# EAGLE board OEPS_V2 (EAGLE 9.5.2)
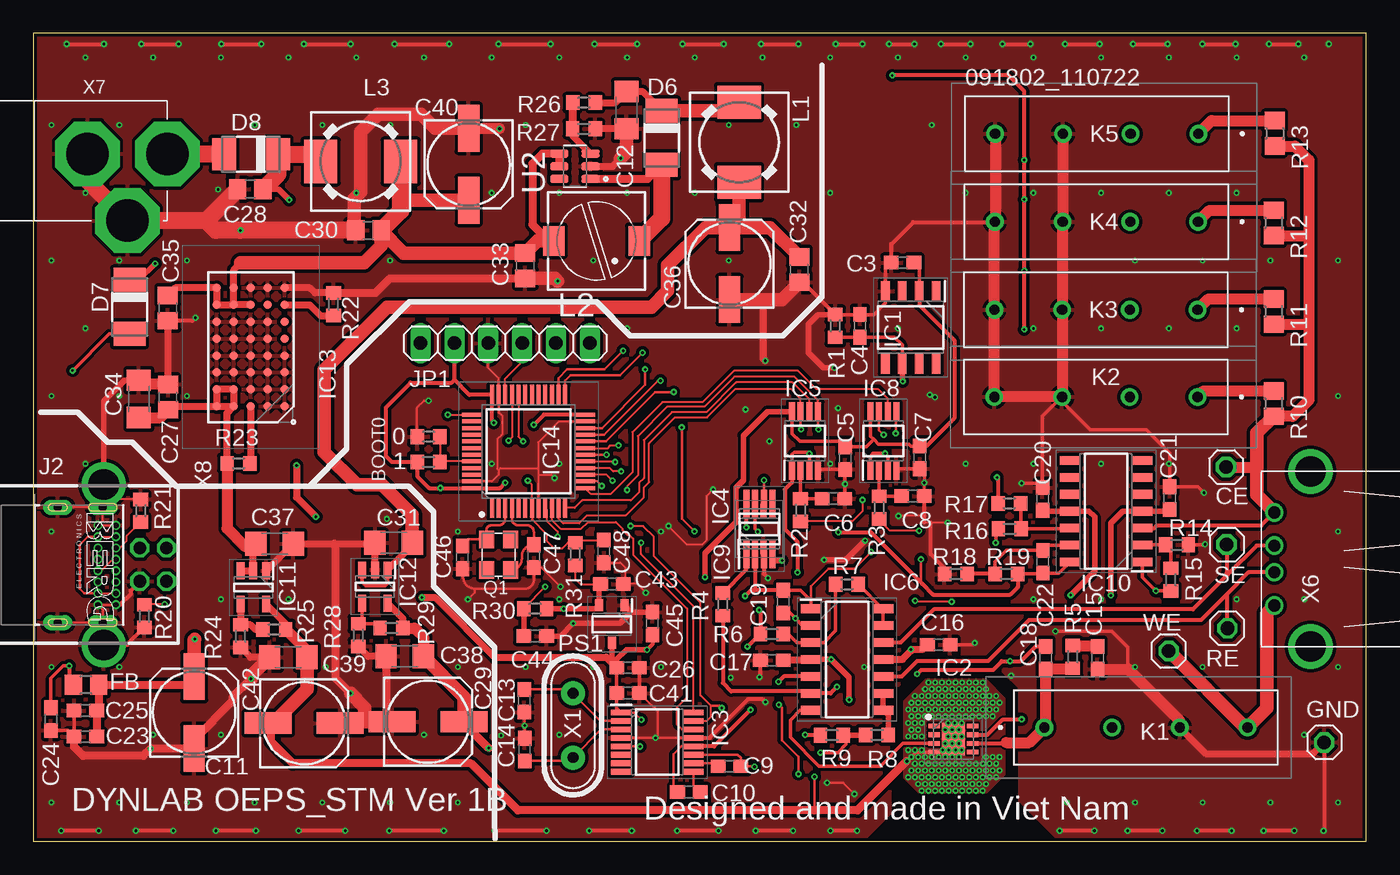
[diagram p5: board, top side]
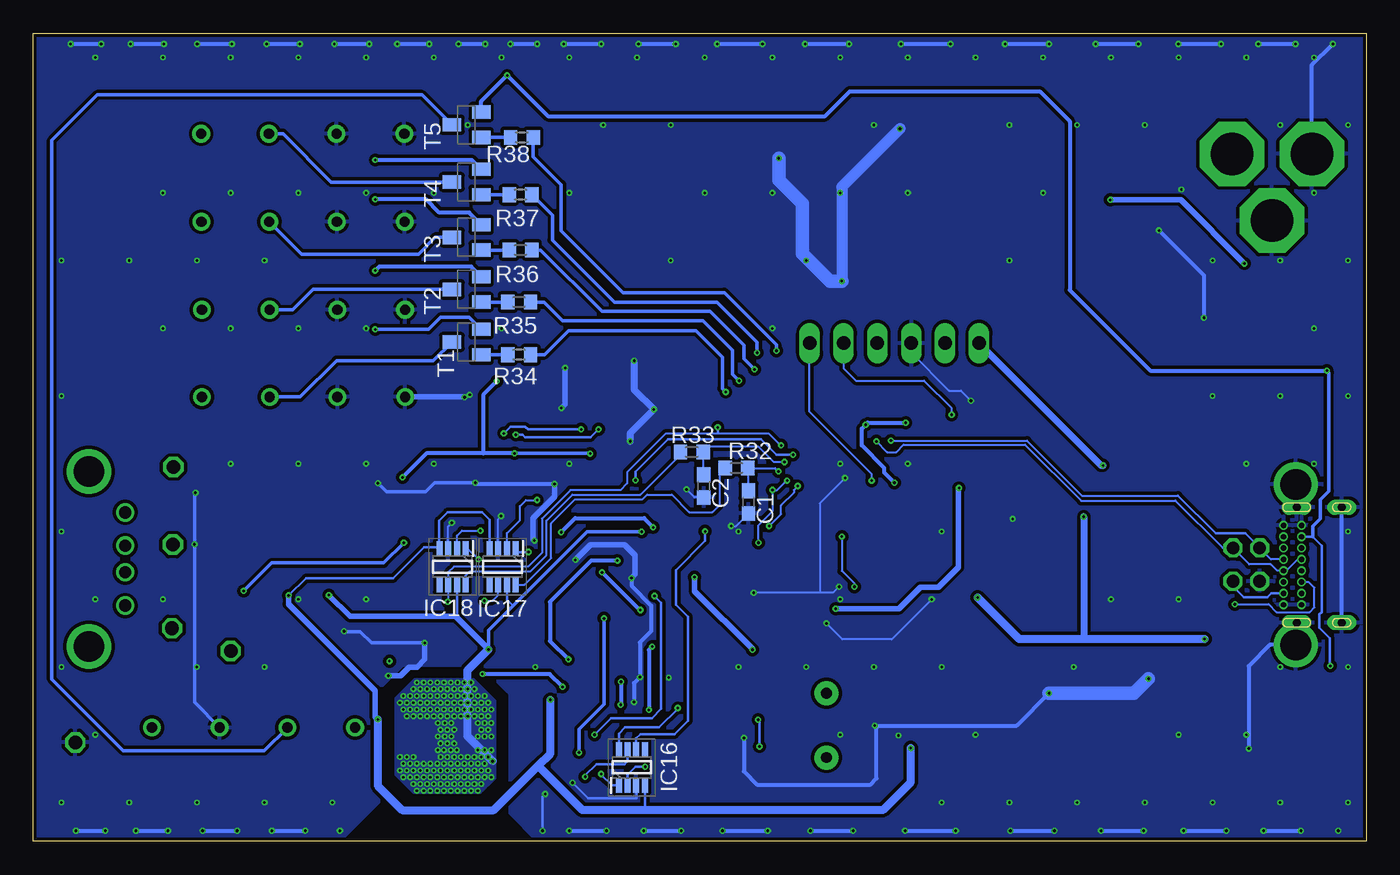
[diagram p6: board, bottom side, seen from below]

Size 100 x 60.6 mm. Coordinates in mm from the lower left corner, seen from the top.
Outline: 0,0 100,0 100,60.6 0,60.6 0,0
Copper layers (1*16): Top 0.035mm / dielectric 1.5mm / Bottom 0.035mm
Design rules "default *": minimum track width 6mil, minimum drill 7mil, track to track 6mil, track to pad 6mil, pad to pad 6mil, via to via 6mil, smd to smd 6mil, copper to edge 0.2mm, drill to drill 6mil, minimum pad ring 5mil, minimum via ring 5mil, stop-mask expansion 4mil, vias tented up to drill 10mil, thermal gap 10mil

## Footprints (pad centres in the part's own frame; a part is rotated, then mirrored left to right if it is on the bottom)
R0603 = smd 1 x 1.1: 1 -0.85,0; 2 0.85,0
C0603 = smd 1.1 x 1: 1 -0.85,0; 2 0.85,0
153CLV-0605 = smd 3.5 x 1.6: + 2.7,0; - -2.7,0
C1206 = smd 1.6 x 1.8: 1 -1.4,0; 2 1.4,0
C0805 = smd 1.3 x 1.5: 1 -0.95,0; 2 0.95,0
1X01 = drill 1.016 octagon: 1 0,0
DO-214AC = smd 1.8 x 2.4: A 2.025,0; C -2.025,0
R0805 = smd 1.3 x 1.5: 1 -0.95,0; 2 0.95,0
SOIC127P600X175-8N = smd 1.525 x 0.65: 1 -2.712,1.905; 2 -2.712,0.635; 3 -2.712,-0.635; 4 -2.712,-1.905; 5 2.712,-1.905; 6 2.712,-0.635; 7 2.712,0.635; 8 2.712,1.905
SON65P300X300X100-9N = smd 0.85 x 0.35: 1 -1.45,0.975; 2 -1.45,0.325; 3 -1.45,-0.325; 4 -1.45,-0.975; 5 1.45,-0.975; 6 1.45,-0.325; 7 1.45,0.325; 8 1.45,0.975 | smd 1.7 x 2.45: 9 0,0
SOP64P600X175-16N = smd 1.528 x 0.435: 1 -2.711,2.222; 2 -2.711,1.588; 3 -2.711,0.952; 4 -2.711,0.318; 5 -2.711,-0.318; 6 -2.711,-0.952; 7 -2.711,-1.588; 8 -2.711,-2.222; 9 2.711,-2.222; 10 2.711,-1.588; 11 2.711,-0.952; 12 2.711,-0.318; 13 2.711,0.318; 14 2.711,0.952; 15 2.711,1.588; 16 2.711,2.222
SOP65P280X145-8N = smd 1.088 x 0.45: 1 -1.356,0.975; 2 -1.356,0.325; 3 -1.356,-0.325; 4 -1.356,-0.975; 5 1.356,-0.975; 6 1.356,-0.325; 7 1.356,0.325; 8 1.356,0.975
SOP65P490X110-8N@1 = smd 1.4 x 0.45: 1 -2.2,0.975; 2 -2.2,0.325; 3 -2.2,-0.325; 4 -2.2,-0.975; 5 2.2,-0.975; 6 2.2,-0.325; 7 2.2,0.325; 8 2.2,0.975
SOIC127P600X175-14N = smd 1.525 x 0.65: 1 -2.712,3.81; 2 -2.712,2.54; 3 -2.712,1.27; 4 -2.712,0; 5 -2.712,-1.27; 6 -2.712,-2.54; 7 -2.712,-3.81; 8 2.712,-3.81; 9 2.712,-2.54; 10 2.712,-1.27; 11 2.712,0; 12 2.712,1.27; 13 2.712,2.54; 14 2.712,3.81
SOP65P490X110-8N = smd 1.45 x 0.45: 1 -2.225,0.975; 2 -2.225,0.325; 3 -2.225,-0.325; 4 -2.225,-0.975; 5 2.225,-0.975; 6 2.225,-0.325; 7 2.225,0.325; 8 2.225,0.975
SOT95P280X100-5N = smd 1.25 x 0.6: 1 -1.25,0.95; 2 -1.25,0; 3 -1.25,-0.95; 4 1.25,-0.95; 5 1.25,0.95
BGA40C127P5X8_625X1125X512 = smd 0.635 x 0.635: A1 -2.54,4.445; A2 -1.27,4.445; A3 0,4.445; A4 1.27,4.445; A5 2.54,4.445; B1 -2.54,3.175; B2 -1.27,3.175; B3 0,3.175; B4 1.27,3.175; B5 2.54,3.175; C1 -2.54,1.905; C2 -1.27,1.905; C3 0,1.905; C4 1.27,1.905; C5 2.54,1.905; D1 -2.54,0.635; D2 -1.27,0.635; D3 0,0.635; D4 1.27,0.635; D5 2.54,0.635; E1 -2.54,-0.635; E2 -1.27,-0.635; E3 0,-0.635; E4 1.27,-0.635; E5 2.54,-0.635; F1 -2.54,-1.905; F2 -1.27,-1.905; F3 0,-1.905; F4 1.27,-1.905; F5 2.54,-1.905; G1 -2.54,-3.175; G2 -1.27,-3.175; G3 0,-3.175; G4 1.27,-3.175; G5 2.54,-3.175; H1 -2.54,-4.445; H2 -1.27,-4.445; H3 0,-4.445; H4 1.27,-4.445; H5 2.54,-4.445
QFP50P900X900X160-48N = smd 1.475 x 0.3: 1 -4.238,2.75; 2 -4.238,2.25; 3 -4.238,1.75; 4 -4.238,1.25; 5 -4.238,0.75; 6 -4.238,0.25; 7 -4.238,-0.25; 8 -4.238,-0.75; 9 -4.238,-1.25; 10 -4.238,-1.75; 11 -4.238,-2.25; 12 -4.238,-2.75; 25 4.238,-2.75; 26 4.238,-2.25; 27 4.238,-1.75; 28 4.238,-1.25; 29 4.238,-0.75; 30 4.238,-0.25; 31 4.238,0.25; 32 4.238,0.75; 33 4.238,1.25; 34 4.238,1.75; 35 4.238,2.25; 36 4.238,2.75 | smd 0.3 x 1.475: 13 -2.75,-4.238; 14 -2.25,-4.238; 15 -1.75,-4.238; 16 -1.25,-4.238; 17 -0.75,-4.238; 18 -0.25,-4.238; 19 0.25,-4.238; 20 0.75,-4.238; 21 1.25,-4.238; 22 1.75,-4.238; 23 2.25,-4.238; 24 2.75,-4.238; 37 2.75,4.238; 38 2.25,4.238; 39 1.75,4.238; 40 1.25,4.238; 41 0.75,4.238; 42 0.25,4.238; 43 -0.25,4.238; 44 -0.75,4.238; 45 -1.25,4.238; 46 -1.75,4.238; 47 -2.25,4.238; 48 -2.75,4.238
GCT_USB4085-GF-A_REVA = drill 0.4 pad 0.65: A1 -2.975,4.025; A4 -2.125,4.025; A5 -1.275,4.025; A6 -0.425,4.025; A7 0.425,4.025; A8 1.275,4.025; A9 2.125,4.025; A12 2.975,4.025; B1 2.975,2.675; B4 2.125,2.675; B5 1.275,2.675; B6 0.425,2.675; B7 -0.425,2.675; B8 -1.275,2.675; B9 -2.125,2.675; B12 -2.975,2.675 | drill 0.6 pad 1.108 long: P1 -4.325,3.045; P2 4.325,3.045; P3 4.325,-0.335; P4 -4.325,-0.335
1X06 = drill 1.016 long: 1 -6.35,0; 2 -3.81,0; 3 -1.27,0; 4 1.27,0; 5 3.81,0; 6 6.35,0
90070501 = drill 0.77 pad 1.32: 1 0,0; 2 5.08,0; 3 10.16,0; 4 15.24,0
DR74 = smd 2.5 x 3.25: 1 -3,0; 2 3,0
PIS2816 = smd 2.2 x 1.6: 1 0,3.2; 2 0,-3.2
SOT95P280X130-3N = smd 0.9 x 0.6: 1 -1.4,0.95; 2 -1.4,-0.95; 3 1.4,0
3.2X2.5_KX-7 = smd 1.3 x 1.1: 1 -1.15,-0.9; 2 1.15,-0.9; 3 1.15,0.9; 4 -1.15,0.9
SOT23-BEC = smd 1 x 1.4: B -0.95,-1.1; C 0,1.1; E 0.95,-1.1
SOT95P280X145-6N = smd 1.37 x 0.59: 1 -1.17,0.95; 2 -1.17,0; 3 -1.17,-0.95; 4 1.17,-0.95; 5 1.17,0; 6 1.17,0.95
HC49 = drill 0.813 pad 1.8: 1 -2.413,0; 2 2.413,0
USB-A-H = drill 0.914: D+ 2.718,-1.003; D- 2.718,1.003; GND 2.718,-3.493; VBUS 2.718,3.493 | drill 2.311: P$5 0,-6.566; P$6 0,6.566
DC-21MM = drill 3.2 pad 4.826 octagon: 1 -5.08,-3.353; 2 -0.076,-6.35; 3 -0.076,-0.356
PN61729-S = drill 0.95 octagon: 1 1.25,4.71; 2 -1.25,4.71; 3 -1.25,2.71; 4 1.25,2.71 | drill 2.3 pad 2.9: S1 -6.02,0; S2 6.02,0

## Placement (x,y rotation side)
0  10K  [R0603]  29.65,30.35 0 top
1  10K  [R0603]  29.65,28.45 180 top
C1  100nF  [C0603]  46.35,25.45 270 bottom
C2  100nF  [C0603]  49.7,26.65 270 bottom
C3  100nF  [C0603]  65.22,43.4 180 top
C4  100nF  [C0603]  62.02,38.66 90 top
C5  100nF  [C0603]  60.9,28.75 270 top
C6  100nF  [C0603]  60.03,25.7 0 top
C7  100nF  [C0603]  66.5,28.79 270 top
C8  100nF  [C0603]  65.99,25.9 0 top
C9  3.3nF  [C0603]  52.23,5.63 180 top
C10  10nF  [C0603]  49.19,3.7 0 top
C11  6.3V_470uF  [153CLV-0605]  12.07,9.66 90 top
C12  22uF  [C1206]  44.5,54.84 270 top
C13  12pF  [C0603]  36.83,10.55 270 top
C14  12pF  [C0603]  36.87,6.88 90 top
C15  100nF  [C0603]  79.85,13.76 270 top
C16  100nF  [C0603]  67.93,14.74 0 top
C17  100nF  [C0603]  55.4,13.58 0 top
C18  4700pF  [C0603]  75.95,13.76 90 top
C19  12pF  [C0603]  56.26,17.98 270 top
C20  100nF  [C0603]  75.72,25.68 90 top
C21  100nF  [C0603]  85.25,25.75 90 top
C22  12pF  [C0603]  75.74,20.97 90 top
C23  100nF  [C0603]  3.91,7.85 180 top
C24  10nF  [C0603]  1.32,9.17 270 top
C25  10uF  [C0603]  3.91,9.81 180 top
C26  100nF  [C0603]  44.62,13.01 0 top
C27  100nF  [C0805]  10.1,33.32 90 top
C28  100nF  [C0805]  16.28,48.92 180 top
C29  16V_220uF  [153CLV-0605]  29.62,8.97 0 top
C30  100nF  [C0805]  25.14,45.82 180 top
C31  22uF  [C1206]  27.03,22.38 0 top
C32  0.1uF  [C0805]  57.47,42.89 270 top
C33  0.1uF  [C0805]  36.91,43.17 270 top
C34  22uF  [C1206]  7.92,33.18 90 top
C35  100nF  [C0805]  10.09,39.99 270 top
C36  25V_100uF  [153CLV-0605]  52.23,43.33 90 top
C37  22uF  [C1206]  18.11,22.33 180 top
C38  22uF  [C1206]  27.86,13.87 0 top
C39  22uF  [C1206]  19.13,13.8 0 top
C40  25V_100uF  [153CLV-0605]  32.66,50.78 270 top
C41  10uF  [C0603]  44.62,11.11 0 top
C42  16V_220uF  [153CLV-0605]  20.32,8.87 0 top
C43  10uF  [C0603]  43.4,19.3 0 top
C44  100nF  [C0603]  37.65,15.4 0 top
C45  100nF  [C0603]  46.45,16.35 90 top
C46  10pF  [C0603]  32.2,21.3 90 top
C47  10pF  [C0603]  37.55,21.4 90 top
C48  100nF  [C0603]  42.8,21.75 270 top
CE  [1X01]  89.48,28.07 0 top
D6  SS34  [DO-214AC]  47.15,52.76 270 top
D7  SS34  [DO-214AC]  7.23,40.08 270 top
D8  SS34  [DO-214AC]  16.33,51.53 180 top
FB  0R  [R0805]  3.96,11.74 180 top
GND  [1X01]  96.85,7.42 0 top
IC1  ADR421BRZ  [SOIC127P600X175-8N]  65.83,38.55 270 top
IC2  BUF634AIDRBR  [SON65P300X300X100-9N]  69.03,7.67 0 top
IC3  DAC1220E_2K5  [SOP64P600X175-16N]  46.81,7.44 0 top
IC4  DG449DS-T1-E3  [SOP65P280X145-8N]  54.47,23.43 90 top
IC5  MCP3551T-E_MS  [SOP65P490X110-8N@1]  57.9,30.03 90 top
IC6  OPA4192ID  [SOIC127P600X175-14N]  61.05,13.64 0 top
IC8  MCP3551T-E_MS  [SOP65P490X110-8N@1]  63.78,30.03 90 top
IC9  ADG1419BRMZ  [SOP65P490X110-8N]  54.48,23.43 90 top
IC10  OPA4192ID  [SOIC127P600X175-14N]  80.48,24.76 180 top
IC11  ADP7182AUJZ-R7  [SOT95P280X100-5N]  16.51,19.05 270 top
IC12  ADP7118AUJZ-R7  [SOT95P280X100-5N]  25.63,19.11 270 top
IC13  LTM8045IY#PBF  [BGA40C127P5X8_625X1125X512]  16.31,37.07 180 top
IC14  STM32F072C8T6  [QFP50P900X900X160-48N]  37.15,29.25 90 top
IC16  DG449DS-T1-E3  [SOP65P280X145-8N]  55.1,5.55 90 bottom
IC17  DG449DS-T1-E3  [SOP65P280X145-8N]  64.8,20.6 270 bottom
IC18  DG449DS-T1-E3  [SOP65P280X145-8N]  68.55,20.6 270 bottom
J2  USB4085-GF-A_REVA  [GCT_USB4085-GF-A_REVA]  2.17,20.72 270 top
JP1  [1X06]  35.4,37.36 0 top
K1  9007-05-01  [90070501]  75.86,8.54 0 top
K2  9007-05-01  [90070501]  87.34,33.33 180 top
K3  9007-05-01  [90070501]  87.35,39.87 180 top
K4  9007-05-01  [90070501]  87.38,46.47 180 top
K5  9007-05-01  [90070501]  87.41,53.07 180 top
L1  CD74R-47uH  [DR74]  52.95,52.43 270 top
L2  22uH  [PIS2816]  42.25,45.03 270 top
L3  CD74R-47uH  [DR74]  24.56,50.99 0 top
PS1  XC6206P332MR-G  [SOT95P280X130-3N]  43.4,16.3 270 top
Q1  32M  [3.2X2.5_KX-7]  34.9,21.5 90 top
R1  10k  [R0603]  60.17,38.65 270 top
R2  1k  [R0603]  57.56,24.84 90 top
R3  1k  [R0603]  63.46,25.03 90 top
R4  10k  [R0603]  51.73,17.77 270 top
R5  27R  [R0603]  77.99,13.83 90 top
R6  75k*  [R0603]  55.41,15.54 180 top
R7  402k*  [R0603]  61.04,19.28 0 top
R8  402k*  [R0603]  63.29,7.98 0 top
R9  75k*  [R0603]  59.91,7.96 0 top
R10  1R*  [R0805]  93.05,32.83 270 top
R11  10R*  [R0805]  93.05,39.73 270 top
R12  1k*  [R0805]  93.05,46.38 270 top
R13  100k*  [R0805]  93.13,53.1 270 top
R14  2k*  [R0603]  85.81,22.24 0 top
R15  18k*  [R0603]  85.34,19.63 90 top
R16  75k*  [R0603]  73.25,23.44 180 top
R17  75k*  [R0603]  73.23,25.34 180 top
R18  75k*  [R0603]  69.22,20.04 0 top
R19  75k*  [R0603]  73.01,20.06 0 top
R20  5.1k  [R0603]  8.33,16.89 270 top
R21  5.1k  [R0603]  8.06,24.79 90 top
R22  60.4k  [R0603]  22.53,40.28 270 top
R23  178k  [R0603]  15.39,28.35 180 top
R24  8.87k*  [R0603]  15.55,15.39 270 top
R25  88.7k*  [R0603]  18.08,15.89 180 top
R26  27k  [R0603]  41.31,55.4 0 top
R27  1k  [R0603]  41.31,53.44 180 top
R28  10k*  [R0603]  24.39,15.47 270 top
R29  100k*  [R0603]  26.87,16 180 top
R30  100R  [R0603]  37.65,17.45 0 top
R31  10K  [R0603]  40.65,21.55 270 top
R32  1k  [R0603]  47.25,28 0 bottom
R33  1k  [R0603]  50.6,29.2 0 bottom
R34  1K  [R0603]  63.55,36.5 180 bottom
R35  1K  [R0603]  63.55,40.45 180 bottom
R36  1K  [R0603]  63.45,44.35 180 bottom
R37  1K  [R0603]  63.45,48.5 180 bottom
R38  1K  [R0603]  63.35,52.8 180 bottom
RE  [1X01]  89.59,15.98 180 top
SE  [1X01]  89.53,22.25 0 top
T1  2N3906  [SOT23-BEC]  67.5,37.45 90 bottom
T2  2N3906  [SOT23-BEC]  67.5,41.4 90 bottom
T3  2N3906  [SOT23-BEC]  67.5,45.3 90 bottom
T4  2N3906  [SOT23-BEC]  67.5,49.45 90 bottom
T5  [SOT23-BEC]  67.5,53.75 90 bottom
U2  MT3608  [SOT95P280X145-6N]  40.64,50.63 180 top
WE  [1X01]  85.19,14.28 180 top
X1  2.5Mhz  [HC49]  40.49,8.7 270 top
X6  USB-A-H  [USB-A-H]  95.83,21.18 180 top
X7  [DC-21MM]  3.71,51.63 90 top
X8  PN61729-S  [PN61729-S]  5.28,20.75 270 top

## Tracks (layer width: path | path; a pad name or v marks a point on that pad's centre or on a via)
3.3V  (via drill 0.2)
  Top 0.152: R31.2 40.65,19.7 41.05,19.3 C43.1
  Top 0.305: 31.59,34.61 32.71,33.49 IC14.36 34.4,31.55 v34.55,31.4 | 31.59,34.61 JP1.2 | 31.59,34.61 31.39,34.4 28.3,34.4 26.45,32.55 26.45,28.9 26.9,28.45 1.2 28.8,27.4 29.7,26.5 v30.55,26.5 IC14.48 35,26.5 v35.4,26.9 | IC14.24 38.3,32 v37.55,31.25
  Top 0.406: C43.1 42.45,19.2 PS1.2 42.2,17.45 v39.8,17.45 R30.2
  Bottom 0.305: v35.4,26.9 36.15,27.65 36.15,28 37.85,29.7 37.85,30.95 v37.55,31.25 37.4,31.4 v34.55,31.4
  Bottom 0.406: v39.8,17.45 35.05,17.45 33.45,19.05 32.1,19.05 30.6,20.55 30.6,26.45 v30.55,26.5
3.3V_VDDA  (via drill 0.2)
  Top 0.152: IC14.9 38.52,24.89 38.52,24.05 39.34,23.23 v39.34,22.86 | v38.4,19.1 36.8,17.5 R30.1
  Top 0.406: R30.1 C44.1
  Bottom 0.152: v39.34,22.86 39.34,20.29 38.4,19.35 v38.4,19.1
5V  (via drill 0.2)
  Top 0.2: IC3.1 45.07,9.66 v45.62,9.11 | v45.52,7.11 IC3.5
  Top 0.254: C3.1 66.47,43.01 IC1.2 | IC5.8 56.92,30.58 57.5,30 60.5,30 C5.1 62.5,29.6 63.05,30.15 | C7.1 65.86,29.64 65.7,29.8 63.4,29.8 63.05,30.15 | 63.05,30.15 62.8,30.39 IC8.8 | IC3.1 43.77,9.99 C41.1 43.77,12.95 C26.1
  Top 0.305: IC1.2 66.47,40.19 69.09,37.57 69.09,31.73 67,29.64 C7.1 | C45.1 46.45,14.77 v46.05,14.37
  Top 0.406: IC5.8 55.07,32.23 53.26,30.43 53.26,27.06 52.7,26.5 52.7,23.93 50.39,21.62 v50.39,19.82 | v46.05,14.37 44.5,14.37 43.77,13.64 43.77,12.95 43.4,13.32 PS1.3
  Top 0.508: C26.1 42.97,13.81 34.6,13.81 30.13,18.29 v29.16,18.29 | v19.75,28.2 19.75,25.8 v21.2,24.35
  Top 0.61: C23.1 C25.1 4.91,9.96 FB.1 11.45,11.74 C11.+
  Top 1.016: C11.+ 12.07,15.12 v12.12,15.17
  Bottom 0.2: v45.62,9.11 45.52,9.01 v45.52,7.11
  Bottom 0.406: v50.39,19.82 50.39,18.77 46.05,14.43 v46.05,14.37
  Bottom 0.508: JP1.1 19.89,28.2 v19.75,28.2 | v21.2,24.35 21.2,15.17
  Bottom 0.61: v12.12,15.17 21.2,15.17 26.04,15.17 v29.16,18.29
12VIN
  Top 0.508: C35.1 10.66,41.51 IC13.H5 IC13.G5 IC13.G4 | IC13.G4 IC13.H4 15.04,42.86 15.57,43.39 | IC13.G3 IC13.G4
  Top 0.61: U2.5 U2.4 38.19,51.58 37.44,50.83 37.44,46.26 38.66,45.03 L2.2
  Top 1.016: 15.57,43.39 24.82,43.39 26.09,44.66 C30.1 27.79,44.12 C33.1 37.82,45.03 38.66,45.03 | C40.+ 27.77,48.08 27.56,48.29
  Top 1.27: C30.1 27.56,47.29 27.56,48.29 L3.2
+13.4V  (via drill 0.2)
  Top 0.305: IC2.7 71.59,8 72.75,9.15 v74.15,9.15
  Top 0.406: C21.1 85.12,24.76 IC10.4 81.75,24.76 80.85,23.85 v80.85,18.44 | v61.21,10.62 61.21,12.29 v59.86,13.64 IC6.4 | IC4.4 IC9.4 55.6,21.06 v56.19,21.06
  Top 0.508: IC6.4 58.28,13.58 C17.2 | IC12.5 27.72,16.71 R29.1
  Top 0.61: v34.16,6.99 32.32,8.84 C29.+
  Top 0.813: R29.1 28.61,16 29.26,15.34 C38.2
  Top 1.016: C38.2 32.32,10.82 C29.+
  Bottom 0.2: IC17.4 65.78,24.12 66.35,24.7 68.9,24.7 69.55,24.05 69.55,21.98 IC18.4 69.62,22.05 70.7,22.05 73,19.75 79.55,19.75 80.85,18.45 v80.85,18.44 | IC16.4 54.12,2.42 54.05,2.34
  Bottom 0.305: v56.19,21.06 58.14,21.06 61.24,17.95 61.24,15.03 v59.86,13.64
  Bottom 0.406: v80.85,18.44 80.85,17.8 74.35,11.3 74.35,9.35 v74.15,9.15
  Bottom 0.61: v74.15,9.15 74.15,4.18 72.31,2.34 65.45,2.34 62.13,5.67 | v61.21,10.62 61.21,6.58 62.13,5.67 | v34.16,6.99 34.16,4.44 36.26,2.34 54.05,2.34 58.8,2.34 62.13,5.67
+15V
  Top 0.254: IC12.1 26.58,19.37 26.39,19.18 24.92,19.18 24.68,19.42 IC12.3
  Top 0.508: C31.2 28.43,22.2 IC12.1
  Top 1.016: L1.2 52.95,46.75 C36.+ | C36.+ 55.28,46.03 C32.1 | C36.+ 50.42,46.03 47.6,43.21 47.6,41.28 46.39,40.07 26.54,40.07 21.82,35.35 21.82,29.18 24.28,26.73 26.18,26.73 28.43,24.48 C31.2
-13.4V  (via drill 0.18, 0.2)
  Top 0.152: IC2.4 68.75,6.7 69.03,6.98 IC2.9
  Top 0.2: v58.6,4.85 58.6,2.33
  Top 0.254: IC2.4 66.23,6.7 v65.54,6.01 | IC4.7 54.15,23.43 v54.36,23.22
  Top 0.305: IC9.7 IC4.7
  Top 0.406: C20.1 75.79,24.76 IC10.11 79.2,24.76 79.63,24.34 79.63,20.27 v77.83,18.47
  Top 0.508: IC6.11 65.21,13.64 65.85,14.28 v65.85,14.39 66.73,14.39 C16.1 | IC11.5 18.93,16.33 R25.1
  Top 0.61: v65.54,6.01 65.52,6.01 61.84,2.33 58.6,2.33 36.36,2.33 32.84,5.84 19.46,5.84 17.83,7.47 17.83,8.71 17.98,8.87
  Top 0.813: R25.1 20.53,14.3 C39.2
  Top 1.016: C39.2 20.53,11.41 17.98,8.87 C42.-
  Bottom 0.2: IC17.7 64.47,18.12 64.01,17.66 | IC18.7 68.22,16.77 | IC16.7 55.42,6.03 55.65,5.8 57.75,5.8 58.6,4.95 v58.6,4.85
  Bottom 0.254: v54.36,23.22 58.45,23.22 64.01,17.66 65.85,15.81 v65.85,14.39
  Bottom 0.406: v77.83,18.47 76.22,16.87 68.33,16.87 68.22,16.77 v65.85,14.39
  Bottom 0.61: v65.85,14.39 67.44,12.8 67.44,7.91 v65.54,6.01
  other vias: 65.63,4.81 65.63,6.84 65.63,7.86 65.63,8.87 65.63,9.89 66.14,4.81 65.89,5.32 66.14,5.82 65.89,6.33 66.14,6.84 66.14,7.86 65.89,8.36 66.14,8.87 65.89,9.38 66.14,9.89 65.89,10.4 66.14,10.9 66.65,3.79 66.39,4.3 66.65,4.81 66.39,5.32 66.65,5.82 66.39,6.33 66.65,6.84 66.65,7.86 66.39,8.36 66.65,8.87 66.39,9.38 66.65,9.89 66.39,10.4 66.65,10.9 67.16,3.79 66.9,4.3 67.16,4.81 66.9,5.32 67.16,5.82 66.9,6.33 66.9,9.38 67.16,9.89 66.9,10.4 67.16,10.9 66.9,11.41 67.16,11.92 67.66,3.79 67.41,4.3 67.66,4.81 67.41,5.32 67.66,5.82 67.41,6.33 67.41,9.38 67.66,9.89 67.41,10.4 67.66,10.9 67.41,11.41 67.66,11.92 68.17,3.79 67.92,4.3 68.17,4.81 67.92,5.32 68.17,5.82 67.92,6.33 68.22,6.84 67.92,9.38 68.17,9.89 67.92,10.4 68.17,10.9 67.92,11.41 68.17,11.92 68.68,3.79 68.43,4.3 68.68,4.81 68.43,5.32 68.68,5.82 68.43,6.33 68.68,6.84 68.43,7.35 68.63,7.86 68.43,8.36 68.63,8.87 68.43,9.38 68.68,9.89 68.43,10.4 68.68,10.9 68.43,11.41 68.68,11.92 69.19,3.79 68.93,4.3 69.19,4.81 68.93,5.32 69.19,5.82 68.93,6.33 69.19,6.84 68.93,7.35 69.14,7.86 68.93,8.36 69.14,8.87 68.93,9.38 69.19,9.89 68.93,10.4 69.19,10.9 68.93,11.41 69.19,11.92 69.7,3.79 69.44,4.3 69.7,4.81 69.44,5.32 69.7,5.82 69.44,6.33 69.65,6.84 69.44,7.35 69.65,7.86 69.44,8.36 69.65,8.87 69.44,9.38 69.7,9.89 69.44,10.4 69.7,10.9 69.44,11.41 69.7,11.92 70.2,3.79 69.95,4.3 70.2,4.81 69.95,5.32 70.2,5.82 69.95,9.38 70.2,9.89 69.95,10.4 70.2,10.9 69.95,11.41 70.2,11.92 70.71,3.79 70.46,4.3 70.71,4.81 70.46,5.32 70.71,5.82 70.46,9.38 70.71,9.89 70.46,10.4 70.71,10.9 70.46,11.41 70.71,11.92 71.22,3.79 70.97,4.3 71.22,4.81 70.97,5.32 71.22,5.82 70.97,9.38 71.22,9.89 70.97,10.4 71.22,10.9 70.97,11.41 71.22,11.92 71.47,4.3 71.73,4.81 71.47,5.32 71.73,5.82 71.47,6.33 71.47,9.38 71.73,9.89 71.47,10.4 71.73,10.9 71.47,11.41 72.24,4.81 71.98,5.32 72.24,5.82 71.98,6.33 71.98,9.38 72.24,9.89 71.98,10.4 72.24,10.9 72.49,5.32 72.49,6.33 72.49,10.4
  pour Bottom (no thermals): 65.3,4.75 65.3,10.55 66.95,12.2 71.45,12.2 72.9,10.75 72.9,5 71.5,3.6 66.45,3.6
  pour Top (no thermals): 67,12.2 71.45,12.2 72.9,10.75 72.9,5 71.55,3.65 71.5,3.6 70.55,3.6 66.45,3.6 65.85,4.2 65.3,4.75 65.3,10.5 65.3,10.55 65.5,10.75 66.95,12.2
-15V
  Top 0.508: C37.2 16.51,22.13 IC11.2 IC11.3 | R23.2 14.54,32.12 IC13.A4 | IC13.A4 IC13.B4 IC13.B5 IC13.A5 | IC13.A5 IC13.A4 | C27.1 10.36,32.62 IC13.A5
  Top 0.813: C34.1 9.51,31.77 C27.1 | R23.2 14.54,23.46 15.87,22.13 16.51,22.13
CC1
  Top 0.152: R21.1 6.99,22.87 6.99,22.51 6.48,22 J2.A5
CC2  (via drill 0.2)
  Top 0.152: v9.86,17.78 8.36,17.78 R20.1
  Bottom 0.152: v9.86,17.78 7.32,17.78 6.73,17.19 4.25,17.19 3.89,17.55 3.89,19.03 4.31,19.45 J2.B5
CE
  Top 0.305: IC10.3 84.09,23.49 84.3,23.7 92.14,23.7 X6.GND
  Top 0.813: R13.2 94.65,52.15 95.7,51.1 95.7,45.5 | R10.2 94.48,31.88 95.7,33.1 95.7,38.6 | 95.7,45.5 95.7,38.6 | R11.2 95.52,38.78 95.7,38.6 | R12.2 95.63,45.43 95.7,45.5 | CE.1 91.75,28.07 91.8,28.12
  Top 1.016: X6.GND 91.8,25.98 91.8,28.12 91.8,30.63 R10.2
CELL_ON  (via drill 0.2)
  Top 0.203: v44.25,36.8 42.85,35.4 40.05,35.4 39.4,34.75 IC14.26
  Bottom 0.254: R38.1 62.5,51.35 60.4,49.25 60.4,45.8 55.75,41.15 48.15,41.15 44.25,37.25 v44.25,36.8
CS1
  Top 0.152: IC3.14 48.65,8.39 48.31,8.73 48.31,10.05 49.05,10.79 49.05,17.45 45,21.5 45,22.7 44.7,23 44.55,23 44.2,23.35 44.2,23.45 43.7,23.95 41.6,23.95 41.1,23.45 39.55,23.45 38.9,24.1 IC14.10
CS2  (via drill 0.2)
  Top 0.152: IC5.7 57.57,33.21 56.84,33.94 52.69,33.94 50.55,31.8 48.15,31.8 46.2,29.85 46.2,26.95 45.8,26.55 45.8,25.8 44.45,24.45 41.55,24.45 40.95,23.85 39.75,23.85 39.4,24.2 IC14.11
  Top 0.2: IC5.7 57.57,30.93 v57.6,30.9 | v63.8,30.5 63.45,30.84 IC8.7
  Bottom 0.203: v63.8,30.5 63.3,30.5 63.1,30.3 58.2,30.3 v57.6,30.9
D+  (via drill 0.2)
  Top 0.152: J2.B6 5.11,20.3 5.96,21.15 J2.A6 | IC14.33 35.9,30.3 v35.65,30.05
  Bottom 0.152: J2.A6 7.14,21.15 X8.3 | v35.65,30.05 25.45,30.05 21.34,25.94 14.12,25.94
  Bottom 0.203: X8.3 9.08,23.09 11.28,23.09 14.12,25.94
D-  (via drill 0.2)
  Top 0.152: IC14.32 36.4,30.35 v36.75,30
  Bottom 0.152: J2.B7 5.14,21.15 5.99,20.3 J2.A7 6.68,20.3 7.16,20.78 8.77,20.78 X8.2 | v36.75,30 35.95,29.2 35.25,29.2 34.7,29.75 25.59,29.75 21.38,25.53 14.3,25.53
  Bottom 0.203: X8.2 10.77,22 14.3,25.53
DAC_OUT  (via drill 0.2)
  Top 0.2: v57.4,5.05 57.4,6.35 56.15,7.6 56.15,10.02 v55.93,10.24
  Top 0.305: IC6.5 56.31,12.37 v55.91,11.97
  Bottom 0.2: IC16.1 56.59,4.19 57.4,5 v57.4,5.05
  Bottom 0.305: v55.91,11.97 55.91,10.27 v55.93,10.24
EXT_ADC1  (via drill 0.2)
  Top 0.152: v62.2,25.6 62.2,24.75 61.44,23.99 R2.1
  Bottom 0.152: IC17.2 64.47,23.12 63.5,24.1 63.5,25.15 63.05,25.6 v62.2,25.6
EXT_ADC2  (via drill 0.2)
  Top 0.152: v66.45,23.3 64.25,23.3 63.46,24.09 R3.1
  Bottom 0.152: IC18.2 68.22,22.93 67.85,23.3 v66.45,23.3
EXT_DAC  (via drill 0.2)
  Top 0.2: C9.1 54.07,5.63 v54.1,5.6
  Top 0.203: IC3.11 52.85,6.49 53.08,6.25 C9.1
  Bottom 0.2: IC16.2 55.42,4.99 54.82,5.6 v54.1,5.6
GND  (via drill 0.18, 0.2)
  Top 0.152: J2.A1 J2.B12 5.22,24.07 J2.P1 | J2.P1 J2.P4 | J2.P1 5.22,26.7 | 5.22,26.7 X8.S1 | J2.A12 J2.B1 5.22,17.38 J2.P2 J2.P3 | R21.2 6.28,25.64 5.22,26.7 | C41.2 46.47,10.11 46.52,10.11 46.82,9.81 46.82,7.75 | C8.2 v66.84,26.9 | IC14.35 34.9,34.75 34.13,35.52 JP1.3 | 0.1 28.8,32.55 29.3,33.05 v29.65,33.05 | v68.6,23.9 67.34,23.9 66.84,23.9 | v64.9,24.4 64.95,24.45 66.84,24.45 | C48.2 44.05,20.9 44.4,20.55 44.4,19.45 44.27,19.32 | 44.27,19.32 C43.2 | C47.1 38.1,20.55 v39.55,19.1 | v45.95,18.65 45.27,19.32 44.27,19.32 | IC14.8 37.9,27.5 | 37.9,27.5 37.9,28 | 37.9,28 37.9,29.95 39.45,31.5 IC14.23 | 34.9,27.85 34.9,27.5 34.4,27 IC14.47 | 34.9,27.85 35.05,28 37.9,28 | 34.9,33.2 34.9,32.2 35.15,31.95 35.15,30.5 34.8,30.15 34.8,27.95 34.9,27.85 | 33.1,18.95 33.1,18.65 v32.6,18.15 | 37.9,27.5 38.85,27.5 v39.1,27.25 | v51,26.4 50.5,25.9 50.5,22.6 50.15,22.25 49.05,22.25 v47.65,23.65
  Top 0.2: C13.2 36.87,9.66 v36.87,8.68 C14.2 | IC3.4 v46.68,7.75 46.82,7.75 IC3.13 | v59.55,4.4 60.75,4.4 v61.6,3.55 | C47.1 37.55,19.6 arc-90 36.9,18.95 33.1,18.95 arc-90 32.25,19.8 32.25,20.4 arc90 C46.1 | IC14.35 34.9,33.2
  Top 0.254: C25.2 3.06,8.03 C23.2 2.59,8.32 C24.2 | C3.2 63.92,42.96 IC1.4 63.92,40.38 63.05,39.51 62.15,39.51 | 62.15,39.51 C4.2 | R1.1 62.14,39.5 62.15,39.51 | C6.2 60.9,25.72 v60.9,26.8 C5.2 58.94,27.9 IC5.4 | v66.84,26.9 66.84,27.6 C7.2 64.86,27.94 IC8.4 | C26.2 C41.2 | K2.3 75.72,31.87 C20.2 75.4,26.85 v74.14,26.85 | K2.3 77.19,32.97 79.3,30.86 83.49,30.86 85.25,29.1 C21.2 87.38,26.6 v87.83,26.14 | v87.91,22.28 87.87,22.24 R14.2 | C16.2 70.49,14.74 v70.64,14.89 | v76.68,15.75 80.92,15.75 82.12,14.56 82.12,12.91
  Top 0.305: IC4.3 IC9.3 54.8,20.06 v55.12,19.74 | v54.48,12.32 54.55,12.39 C17.1 | C3.2 64.37,44.79 66.02,46.44 72.11,46.44 | IC3.13 50.74,7.75 53.62,10.64 54.73,10.64 v54.93,10.44 | R18.1 68.37,20.49 67.34,21.52 67.34,23.9 | 66.84,23.9 66.84,24.45 C8.2 | R20.2 7.01,14.73 X8.S2 | X8.4 7.29,18.8 7.29,18.55 6.49,17.75 J2.A12 | v12.17,39.27 11.93,39.03 C35.2 | C32.2 57.73,41.94 R1.1 | GND.1 96.85,0.85 v96.8,0.8 | v94.6,0.8 v92.3,0.8 | v89.9,0.8 v87.3,0.8 | v84.7,0.8 v82.1,0.8 | v79.6,0.8 v77,0.8 | v61.8,0.8 v59.8,0.8 | v57,0.8 v54.2,0.8 | v51.4,0.8 v48.3,0.8 | v44.9,0.8 v41.7,0.8 | v38.5,0.8 v34.6,0.8 | v30.8,0.8 v26.7,0.8 | v23.4,0.8 v19.9,0.8 | v16.7,0.8 v13.7,0.8 | v10.5,0.8 v7.7,0.8 | v4.9,0.8 v2.1,0.8 | v2.5,59.8 v5.3,59.8 | v8.1,59.8 v10.9,59.8 | v14.1,59.8 v17.1,59.8 | v20.3,59.8 v23.8,59.8 | v27.1,59.8 v31.2,59.8 | v34.9,59.8 v38.8,59.8 | v42.1,59.8 v45.3,59.8 | v48.7,59.8 v51.8,59.8 | v54.6,59.8 v57.4,59.8 | v60.2,59.8 v62.2,59.8 | v64.2,59.8 v66.1,59.8 | v68.1,59.8 v70.3,59.8 | v72.7,59.8 v74.8,59.8 | v77.4,59.8 v80,59.8 | v82.5,59.8 v85.1,59.8 | v87.7,59.8 v90.2,59.8 | v92.7,59.8 v94.9,59.8
  Top 0.406: X8.S1 5.28,32.99 6.86,34.58 C34.2 | v62.41,22.55 60.97,21.11 v59.33,21.11 | R1.1 58.88,39.5 58.14,38.76 58.14,36.66 59.28,35.51 v60.1,35.51 | PS1.1 44.85,17.2 | 44.85,17.2 C45.2 | C44.2 39.55,15.4 v40.5,16.35 44,16.35 44.85,17.2
  Top 0.508: IC12.2 C31.1 25.57,22.33 22.58,22.33 C37.1 17.48,20.3 IC11.1 | C39.1 16.29,13.79 R24.2 | C38.1 25.13,13.87 R28.2 | C27.2 C35.2 | R22.1 21.12,41.13 20.75,41.51 IC13.H1 | C12.2 R27.1 | U2.2 43.46,50.63 v44.07,51.23 | K1.3 87.97,6.58 96.01,6.58 GND.1 | 54.76,40.63 54.76,36.19 v54.91,36.04
  Top 0.61: 3.06,8.03 3.06,7.08 3.73,6.4 8.26,6.4 v8.81,6.96 C11.- 12.07,7.62 14.94,10.49 14.94,10.8 v16.33,12.2 | v23.8,11.1 22.68,12.22 22.68,22.23 22.58,22.33 | C38.1 26.46,9.42 C29.- | R22.1 25.68,41.13 26.76,42.22 C33.2
  Top 0.813: K5.3 77.25,46.5 K4.3 77.22,39.9 K3.3 K2.3 K2.4 K3.4 72.11,46.44 K4.4 72.17,46.5 K5.4 | C15.2 82.12,12.91 82.16,12.91 86.02,9.05 K1.3 | C27.2 8.23,34.27 C34.2 | C40.- 34.94,53.48 v34.98,53.45
  Top 1.016: C42.+ 23.12,8.97 24.87,8.97 | 24.87,8.97 C29.- | C39.1 16.33,12.4 v16.33,12.2 | v23.8,11.1 24.87,10.04 24.87,8.97 | C32.2 56.16,40.63 54.76,40.63 C36.- | v44.07,51.23 44.5,51.67 C12.2 | v39.34,42.02 39.14,42.22 C33.2 | C40.- 30.14,53.48 29.08,54.54 25.88,54.54 24.56,53.22 24.56,48.7 24.05,48.19 24.05,45.96 C30.2
  Top 1.27: C28.2 12.96,46.55 | 12.96,46.55 X7.1 4.07,49.55 X7.3 | C30.2 v15.54,45.82 13.69,45.82 12.96,46.55
  Bottom 0.152: v29.65,33.05 30.4,33.8 31.3,33.8 34.13,36.63 JP1.3 | IC18.3 68.88,23.62 v68.6,23.9 | IC17.3 65.12,24.18 v64.9,24.4 | v39.55,19.1 40,18.65 41,18.65 | 41,18.65 v45.95,18.65 | v32.6,18.15 35.6,15.15 39.3,15.15 v40.5,16.35 | v39.1,27.25 41,25.35 41,18.65 | C2.2 50.4,25.8 v51,26.4 | v47.65,23.65 47.3,23.65 C1.2
  Bottom 0.2: IC16.3 54.75,4.17 54.75,3.25 58.4,3.25 v59.55,4.4 | v61.6,3.55 61.8,3.35 v61.8,0.8
  Bottom 0.254: v87.83,26.14 87.91,26.06 v87.91,22.28 87.91,10.43 K1.3 | v66.84,26.9 69.9,26.9 70.59,26.22 73.51,26.22 v74.14,26.85 | v70.64,14.89 74.62,14.89 75.46,15.73 76.66,15.73 v76.68,15.75
  Bottom 0.305: v60.9,26.8 66.74,26.8 v66.84,26.9 | v54.93,10.44 54.93,11.87 v54.48,12.32 54.48,14.91 53.64,15.76 53.64,17.67 55.12,19.16 v55.12,19.74 | v15.54,45.82 12.17,42.45 v12.17,39.27 | v46.68,7.75 46.68,5.25 45.69,4.26 37.18,4.26 36.73,4.72 36.73,8.54 v36.87,8.68 26.22,8.68 v23.8,11.1 | X8.S2 7.22,14.73 8.81,13.13 v8.81,6.96 | J2.P3 J2.P4 | v96.8,0.8 v94.6,0.8 | v92.3,0.8 v89.9,0.8 | v87.3,0.8 v84.7,0.8 | v82.1,0.8 v79.6,0.8 | v59.8,0.8 v57,0.8 | v54.2,0.8 v51.4,0.8 | v48.3,0.8 v44.9,0.8 | v41.7,0.8 v38.5,0.8 | v34.6,0.8 v30.8,0.8 | v26.7,0.8 v23.4,0.8 | v19.9,0.8 v16.7,0.8 | v13.7,0.8 v10.5,0.8 | v7.7,0.8 v4.9,0.8 | X7.3 4.07,58.23 v2.5,59.8 | v5.3,59.8 v8.1,59.8 | v10.9,59.8 v14.1,59.8 | v17.1,59.8 v20.3,59.8 | v23.8,59.8 v27.1,59.8 | v31.2,59.8 v34.9,59.8 | v38.8,59.8 v42.1,59.8 | v45.3,59.8 v48.7,59.8 | v51.8,59.8 v54.6,59.8 | v57.4,59.8 v60.2,59.8 | v62.2,59.8 v64.2,59.8 | v66.1,59.8 v68.1,59.8 | v70.3,59.8 v72.7,59.8 | v74.8,59.8 v77.4,59.8 | v80,59.8 v82.5,59.8 | v85.1,59.8 v87.7,59.8 | v90.2,59.8 v92.7,59.8 | v94.9,59.8 v97.2,59.8
  Bottom 0.406: v60.9,26.8 60.9,25.85 62.51,24.24 62.51,22.65 v62.41,22.55 | v59.33,21.11 58.19,22.25 55.65,22.25 54.84,21.44 54.84,20.02 v55.12,19.74 | v60.1,35.51 60.1,32.77 v60.38,32.49 | K2.4 67.67,33.33 v67.64,33.3 | v73.36,12.42 72.46,12.42 71.81,13.07 71.21,13.07 70.64,13.64 v70.64,14.89
  Bottom 0.508: v54.91,36.04 54.91,33.86 v53.44,32.39 55.22,30.61 v55.22,30
  Bottom 0.61: J2.P2 5.28,16.33 X8.S2
  Bottom 0.813: v34.98,53.45 39.34,49.08 v39.34,42.02
  Bottom 1.016: v16.33,12.2 17.42,11.1 v23.8,11.1 | v44.07,51.23 44.07,49.58 42.29,47.81 42.29,44.07 40.23,42.02 v39.34,42.02
  other vias: 1.37,2.92 1.37,13.08 1.37,23.24 1.37,33.4 1.37,43.56 1.37,53.72 6.45,2.92 6.45,13.08 3.91,28.32 6.45,33.4 3.91,38.48 6.45,43.56 3.91,48.64 6.45,53.72 3.91,58.8 11.53,2.92 8.99,8 8.99,28.32 11.53,33.4 11.53,43.56 8.99,58.8 16.61,2.92 14.07,8 14.07,18.16 13.87,48.89 16.61,53.72 14.07,58.8 21.69,2.92 21.94,13.08 19.15,18.16 21.69,53.72 19.15,58.8 26.77,2.92 26.52,24.19 26.77,43.56 24.23,48.64 26.77,53.72 24.23,58.8 31.85,2.92 29.31,8 31.85,13.08 31.85,23.24 29.31,58.8 35.09,7.95 36.93,13.08 34.39,28.32 34.39,48.64 36.93,53.72 34.39,58.8 39.47,8 42.01,13.08 39.47,18.16 39.47,28.32 42.01,43.56 39.47,48.64 39.47,58.8 47.09,13.08 47.09,23.24 44.55,38.48 44.55,48.64 44.55,58.8 52.32,12.28 52.17,43.56 49.63,48.64 52.17,53.72 49.63,58.8 57.25,53.72 54.71,58.8 62.33,13.08 59.79,28.32 59.79,48.64 59.79,58.8 67.26,33.5 64.87,38.48 67.41,53.72 64.87,58.8 69.95,28.32 69.95,48.64 69.95,58.8 77.57,2.92 75.03,18.16 75.03,28.32 75.03,38.48 75.03,48.64 75.03,58.8 82.65,2.92 82.65,13.08 80.11,18.16 80.11,28.32 80.11,38.48 82.65,43.56 80.11,48.64 80.11,58.8 87.73,2.92 87.73,13.08 85.19,28.32 85.19,38.48 87.73,43.56 85.19,48.64 85.19,58.8 92.81,2.92 90.27,18.16 90.27,38.48 92.81,43.56 90.27,48.64 90.27,58.8 97.89,2.92 95.35,8 97.89,13.08 95.35,18.16 97.89,23.24 97.89,33.4 97.89,43.56 95.35,58.8
  pour Bottom (isolate 0.254): 0.05,60.55 99.95,60.55 99.95,0.1 77,0.1 75.05,2.05 74,3.1 74,9.55 74,11.55 72.4,13.15 72.3,13.25 68,13.25 66.4,13.25 64.5,11.35 64.25,11.1 64.25,7.85 64.25,2.15 62.2,0.1 0.05,0.1
  pour Top (isolate 0.254): 0.7,0.1 62.2,0.1 63.85,1.75 64.25,2.15 64.25,5.7 64.25,11.1 65.3,12.15 66.4,13.25 68.7,13.25 72.3,13.25 72.85,12.7 74,11.55 74,3.3 74,3.1 75.1,2 77,0.1 77.65,0.1 89.6,0.1 99.9,0.1 99.95,0.1 99.95,60.55 0.1,60.55 0.05,60.55 0.05,0.1 0.5,0.1 0.65,0.1
I_E_SWITCH  (via drill 0.2)
  Top 0.152: v68.9,17.97 66.23,17.97 v66.15,18.05 | IC14.19 43.1,29.5 43.3,29.7 v43.9,29.7
  Top 0.2: v49.6,23.25 48.65,24.2 v48.65,31.05
  Bottom 0.152: v68.9,17.97 68.88,17.99 IC18.6 68.88,20.18 68.45,20.6 62.88,20.6 61.85,21.63 61.85,24.2 59.7,26.35 55.95,26.35 55.45,26.85 55.45,27.7 52.55,30.6 48.65,30.6 44.85,30.6 43.85,29.6 43.85,29.65 v43.9,29.7 | v66.15,18.05 65.55,18.05 65.12,18.48 IC17.6
  Bottom 0.2: IC16.6 54.77,7.72 54.45,8.05 51.9,8.05 50.9,9.05 50.9,16.85 51.8,17.75 51.8,20.35 49.6,22.55 v49.6,23.25 | v48.65,31.05 48.65,30.6
I_MEAS  (via drill 0.2)
  Top 0.2: v66.6,21.15 66.6,19.41 66.71,19.31
  Top 0.254: IC10.14 76.94,20.12 C22.1 75.68,20.06 R19.2
  Top 0.305: R19.2 73.86,19.06 73.3,18.5 67.51,18.5 66.71,19.31 62.83,23.18 v60.39,23.18 | IC9.8 53.5,25.4 | 53.5,25.4 IC4.8 | v53.49,23.55 53.49,25.39 53.5,25.4
  Bottom 0.2: IC18.1 67.41,21.96 v66.6,21.15
  Bottom 0.305: v60.39,23.18 59.34,24.23 54.18,24.23 v53.49,23.55
MODE_SW  (via drill 0.2)
  Top 0.203: IC9.6 54.8,27.07 v54.81,27.08 | v43,29 IC14.18
  Top 0.305: IC9.6 IC4.6
  Bottom 0.203: v54.81,27.08 54.81,27.73 52.39,30.15 45.4,30.15 44.25,29 v43,29
N$1
  Top 0.254: IC5.2 R2.2 C6.1
N$2
  Top 0.254: IC8.2 R3.2 63.48,25.9 C8.1
N$3
  Bottom 0.254: R34.2 T1.B
N$4
  Top 0.2: C46.2 arc-90 32.7,22.65 Q1.3 34,23.35 arc-90 34.35,23.7 34.9,23.7 arc90 35.4,24.2 IC14.3
N$5
  Top 0.2: C14.1 40.23,6.03 X1.2 42.59,8.39 IC3.3
N$6
  Top 0.2: C13.1 36.84,11.41 40.19,11.41 X1.1 40.49,11.07 42.53,9.03 IC3.2
N$7
  Top 0.203: IC3.10 51.16,5.85 C9.2
N$8
  Top 0.203: C10.2 49.52,4.21 IC3.9
N$9
  Top 0.305: R4.1 53.5,20.4 IC9.1 IC4.1
N$10  (via drill 0.18, 0.2)
  Top 0.305: R4.2 51.73,11.88 52.35,11.25 58.19,11.25 IC6.6 59.81,11.1 v60.3,11.59 | C18.2 75.19,14.61 74.09,13.52 v73.28,13.52 72.67,13.52 72,12.85 66.6,12.85 v66.3,12.55
  Bottom 0.305: v60.3,11.59 61.26,12.55 v66.3,12.55
N$11
  Top 0.254: IC2.3 65.26,7.34 63.56,5.65 58.95,5.65 56.8,7.8 56.8,9.1 57.53,9.83 IC6.7
N$12
  Top 0.305: IC2.6 72.94,7.34 73,7.4
  Top 0.813: R5.1 77.92,12.91 C18.1 75.95,8.63 K1.1 74.72,7.4 73,7.4
N$13
  Top 0.813: R5.2 79.78,14.68 C15.1
N$14
  Top 0.305: IC9.5 IC4.5
N$15
  Top 0.254: R7.1 60.19,15.79 59.31,14.91 IC6.3 57.29,14.91 56.66,15.54 R6.1
N$16  (via drill 0.2)
  Top 0.254: C19.2 56.77,17.13 v57.18,16.72 57.72,16.18 IC6.2 | v59.05,6.66 60.35,6.66 60.96,7.27 60.96,7.96
  Top 0.406: R8.1 62.42,7.96 60.96,7.96 R9.2
  Bottom 0.254: v57.18,16.72 57.18,10.29 59.05,8.41 v59.05,6.66
N$17
  Top 0.813: K2.1 87.79,33.78 R10.1
N$18  (via drill 0.2)
  Top 0.254: R15.1 v84.22,18.78 83.19,19.81 IC10.1 | R16.2 72.2,23.24 v72.2,22.4
  Bottom 0.254: v72.2,22.4 73.71,20.89 82.11,20.89 v84.22,18.78
N$19
  Top 0.813: K3.1 88.16,40.68 R11.1
N$20
  Top 0.254: IC10.2 83.21,22.24 R14.1 85.34,21.86 R15.2
N$21
  Top 0.813: K4.1 88.24,47.33 R12.1
N$22
  Top 0.508: R26.2 43.66,55.4 C12.1 45.69,56.24 D6.C
  Top 1.016: L1.1 52.31,54.79 D6.C
N$23
  Top 0.813: K5.1 88.39,54.05 R13.1
N$24
  Top 0.254: R16.1 74.2,23.44 | 74.2,23.44 77.72,23.44 IC10.12 | R17.1 74.08,23.56 74.2,23.44
N$25  (via drill 0.2)
  Top 0.406: D7.C 7.92,42.11 v9.14,43.34 | v19.2,48.11 18.39,48.92 C28.1
  Top 1.27: L3.1 21.02,51.53 D8.C 18.35,50.05 C28.1
  Bottom 0.406: v9.14,43.34 13.92,48.11 v19.2,48.11
N$26
  Top 0.254: IC10.13 76.14,22.22 C22.2 73.02,21.82 72.16,20.96 R19.1
  Top 0.305: R19.1 70.08,20.06 R18.2
N$27
  Top 0.508: R25.2 16.65,15.89 16.3,16.24 R24.1 IC11.4
N$28
  Top 1.27: X7.2 14.28,51.56 D8.A
N$29
  Top 0.254: IC12.4 24.68,16.61 R28.1 25.7,16.32 R29.2
N$30
  Top 0.2: Q1.1 arc90 36.65,21.2 36.65,21.35 arc-90 C47.2 37.55,23.2 arc90 37.05,23.7 36.4,23.7 arc-90 35.9,24.2 IC14.4
N$31
  Top 0.152: 0.2 1.1 30.55,28.5 IC14.44
N$32
  Bottom 0.254: T2.B R35.2
N$33
  Top 0.508: IC13.G1 20.75,40.24 21.55,39.43 R22.2
N$34
  Top 0.508: IC13.A3 16.31,28.42 R23.1
N$35
  Bottom 0.254: R36.2 T3.B
N$36
  Bottom 0.254: T4.B R37.2
N$37
  Bottom 0.254: T5.B R38.2
N$38
  Top 0.61: U2.1 46.09,49.68 D6.A
  Top 1.27: D6.A 47.15,46.73 L2.1
N$39
  Top 0.508: U2.3 40.46,52.92 R27.2
  Top 0.61: R26.1 R27.2
RANGE1  (via drill 0.2)
  Top 0.203: v48.05,33.7 46.65,33.7 42.95,30 IC14.20
  Bottom 0.254: v48.05,33.7 48.3,33.95 48.3,36.3 50.3,38.3 59.85,38.3 61.65,36.5 R34.1
RANGE2  (via drill 0.2)
  Top 0.203: IC14.21 42.8,30.5 46.85,34.55 v47.05,34.55
  Bottom 0.254: v47.05,34.55 47.55,35.05 47.55,36.85 49.75,39.05 60.3,39.05 61.7,40.45 R35.1
RANGE3  (via drill 0.2)
  Top 0.203: v45.9,35.4 45.9,34.25 42.65,31 IC14.22
  Bottom 0.254: v45.9,35.4 46.7,36.2 46.7,37.2 49.25,39.75 57.35,39.75 61.95,44.35 R36.1
RANGE4  (via drill 0.2)
  Top 0.203: v45.7,36.65 44,34.95 40.3,34.95 39.9,34.55 IC14.25
  Bottom 0.254: R37.1 61.05,46.95 61.05,45.1 56.4,40.45 48.7,40.45 45.7,37.45 v45.7,36.65
RE
  Top 0.305: X6.D- 91.17,20.17 89.59,18.59 | 89.59,18.59 87.6,16.6 74.7,16.6 71.62,13.52 66.31,13.52 65.16,12.37 IC6.10 | RE.1 89.59,18.59
RE_BUFF
  Top 0.406: R8.2 64.14,9.45 IC6.8 IC6.9
RELAY1
  Bottom 0.254: K2.2 79.98,33.33 77.26,36.05 70,36.05 T1.C
RELAY2
  Bottom 0.254: K3.2 80.55,39.87 79.02,41.4 T2.C
RELAY3
  Bottom 0.254: T3.C 69.85,45.3 71.1,44.05 79.88,44.05 K4.2
RELAY4
  Bottom 0.254: T4.C 77.65,49.45 81.27,53.07 K5.2
RELAY_CELL
  Bottom 0.254: K1.2 82.66,6.81 93.24,6.81 98.6,12.17 98.6,52.58 95.2,55.98 70.83,55.98 T5.C
RST  (via drill 0.2)
  Top 0.152: C48.1 40.85,22.6 R31.1 40.1,22.4 39.7,22 39.05,22 38.5,22.55 38.5,23.05 37.4,24.15 IC14.7 37.4,26.75 v37.1,27.05
  Bottom 0.152: v37.1,27.05 37.1,27.55 41.75,32.2 JP1.6
SCK  (via drill 0.2)
  Top 0.152: IC5.5 58.87,33.08 57.1,34.85 52.6,34.85 50.35,32.6 47.55,32.6 45.35,30.4 45.35,27.45 44.55,26.65 v44.55,26.35 | v43.45,27.05 43,27.5 IC14.15 | v45.6,22.4 45.6,21.55 49.52,17.62 IC3.16
  Top 0.2: v58.9,30.9 58.87,30.93 IC5.5
  Top 0.203: v64.7,30.6 64.7,32.17 IC8.5
  Bottom 0.152: v45.6,22.4 45.6,23.7 44.55,24.75 v44.55,26.35 44.2,26.35 43.5,27.05 v43.45,27.05
  Bottom 0.203: v58.9,30.9 62.9,30.9 63.1,31.1 64.2,31.1 v64.7,30.6
SDIO
  Top 0.152: IC5.6 58.22,33.14 56.94,34.42 52.72,34.42 50.5,32.2 47.9,32.2 45.8,30.1 45.8,27.24 45.45,26.88 45.45,26.2 44.83,25.57 41.17,25.57 40.61,25.01 IC14.12
SDIO2
  Top 0.152: IC8.6 64.11,33.2 63.4,33.91 58.75,33.91 57.35,35.31 52.58,35.31 50.22,32.95 47.2,32.95 44.95,30.7 44.95,27.68 43.32,26.05 41.84,26.05 IC14.13
SDIO_DAC  (via drill 0.2)
  Top 0.152: IC3.15 50.52,9.03 50.85,9.35 50.85,10.15 50.83,10.18 50.05,10.95 50.05,17.9 46.55,21.4 46.55,22.85 45.75,23.65 v44.8,23.65 | v42.65,26.65 42.3,27 IC14.14
  Top 0.2: v51.65,10 51.48,10.18 50.83,10.18
  Bottom 0.152: v44.8,23.65 43.9,24.55 43.9,25.2 42.95,26.15 42.95,26.35 v42.65,26.65
  Bottom 0.2: IC16.8 56.08,8.07 55.6,8.55 53.05,8.55 51.65,9.95 v51.65,10
SE
  Top 0.305: X6.D+ 91.78,22.18 89.63,20.03 | IC6.12 65.06,14.91 67.55,17.4 87,17.4 89.63,20.03 | SE.1 89.53,20.12 89.63,20.03
SE_BUFF
  Top 0.254: R7.2 63.72,17.45 IC6.14 IC6.13
STM_ADC1
  Bottom 0.152: IC17.8 63.16,19.24 61.15,21.25 61.15,23.85 59.35,25.65 54.3,25.65 53.95,26 52.1,26 50.8,24.7 49.05,24.7 48.5,25.25 48.5,27.6 R32.1
STM_ADC1_INP  (via drill 0.2)
  Top 0.152: v44.1,27.75 43.5,27.75 43.25,28 IC14.16
  Bottom 0.152: C1.1 46.4,26.35 R32.2 44.35,28 v44.1,27.75
STM_ADC2
  Bottom 0.152: IC18.8 67.58,19.93 67.25,20.25 62.7,20.25 61.51,21.45 61.51,24.05 59.55,26 54.45,26 51.45,29 R33.1
STM_ADC2_INP  (via drill 0.2)
  Top 0.152: IC14.17 43.6,28.5 v43.65,28.45
  Bottom 0.152: C2.1 49.75,27.55 R33.2 49.35,29.6 45.6,29.6 44.45,28.45 v43.65,28.45
SWCLK  (via drill 0.2)
  Top 0.152: v31.1,32 IC14.37
  Bottom 0.152: JP1.5 39.21,35.46 38.3,34.55 33.18,34.55 31.1,32.47 v31.1,32
SWDIO
  Top 0.152: IC14.34 35.4,34.7 36.67,35.97 JP1.4
V_MEAS  (via drill 0.2)
  Top 0.2: v62.85,21.7 61.6,20.45 59.65,20.45 58.34,19.14 58.34,18.06
  Top 0.254: C19.1 57.57,18.83 58.34,18.06 IC6.1
  Top 0.305: R9.1 57.94,7.96 v57.9,8 | C19.1 54.1,18.83 | 54.1,18.83 53.83,18.83 v53.4,18.4 | IC4.2 IC9.2 54.15,18.88 54.1,18.83
  Bottom 0.2: IC17.1 63.57,21.7 v62.85,21.7 | 52.9,9.95 53.6,9.25 56.65,9.25 v57.9,8
  Bottom 0.203: v53.4,18.4 52.9,17.9 52.9,9.95
VBUS  (via drill 0.18, 0.2)
  Top 0.152: J2.B4 J2.A9 | J2.B9 J2.A4
  Top 0.203: J2.B4 3.83,18.6 3.48,18.95 3.48,22.25 4.08,22.85 J2.B9
  Top 0.254: C24.1 1.32,12.25 2.23,13.16 v2.69,13.16 | v2.95,35.31 5.69,38.06 D7.A
  Top 0.305: v2.69,13.16 2.69,12.05 FB.2 | v74.35,38.4 v74.35,42.8 v74.35,48.15 v74.35,51.1 74.35,56.25 73.15,57.45 v64.45,57.45
  Bottom 0.203: J2.A9 7.14,18.6 7.42,18.32 9.17,18.32 9.99,19.14 X8.1 | J2.B9 4.03,22.85 3.33,22.15 3.33,17.2 3.5,17.02 3.5,16 2.74,15.24 2.74,13.21 v2.69,13.16
  Bottom 0.254: 4.03,22.85 4.03,23.64 3.45,24.21 3.45,25.61 2.79,26.27 2.79,35.16 v2.95,35.31 | T1.E 67.3,39.3 69.45,39.3 70.35,38.4 v74.35,38.4
  Bottom 0.305: v2.95,35.31 16.21,35.31 22.25,41.35 22.25,54 24.5,56.25 38.75,56.25 40.6,54.4 61.4,54.4 v64.45,57.45 66.4,55.5 T5.E | T4.E 67.1,51.1 v74.35,51.1 | T3.E 67.3,47.15 69.55,47.15 70.55,48.15 v74.35,48.15 | T2.E 67.15,43.1 74.05,43.1 v74.35,42.8
VREF  (via drill 0.2)
  Top 0.203: C10.1 48.03,4 48.03,6.54 48.61,7.12 IC3.12 | 64,29 v63.9,29.1
  Top 0.254: R1.2 C4.1 64.62,37.81 65.19,37.23 IC1.6 | IC5.1 56.92,29.02 57.1,29.2 58.1,29.2 v58.22,29.08 IC5.3 | IC8.3 64.11,28.89 64,29 | v63.9,29.1 63,29.1 62.8,28.9 IC8.1
  Top 0.305: v72.3,27.3 72.38,27.22 R17.2 | v53.82,9.86 51.08,7.12 IC3.12 | v53.57,14.61 54.5,15.54 R6.2 54.56,17.25 v54.46,17.35 | IC5.1 56.92,26.93 56.39,26.39 56.39,23.4 57.33,22.46 v57.33,20.17
  Top 0.406: IC1.6 65.19,34.53 v65.23,34.5
  Bottom 0.254: v63.9,29.1 58.24,29.1 v58.22,29.08
  Bottom 0.305: v63.9,29.1 66.24,29.1 | 66.24,29.1 70.5,29.1 v72.3,27.3 | v65.23,34.5 66.24,33.48 66.24,29.1 | v53.57,14.61 53.82,14.36 v53.82,9.86 | v57.33,20.17 54.51,17.35 v54.46,17.35
WE
  Top 1.016: X6.VBUS 92.54,17.12 92.54,9.98 K1.4 90.93,8.54 WE.1

## Text on the board
tPlace: 091802_110722 | BOOT0
tNames: WxH: 9.5x11.2mm / DC Power jack | WxH: 13.2x6mm / USB-A | WxH: 9.1x3.5mm / Type-C, rounded corners | DYNLAB OEPS_STM Ver 1B | Designed and made in Viet Nam
tValues: MICA 4mm | MICA 3mm